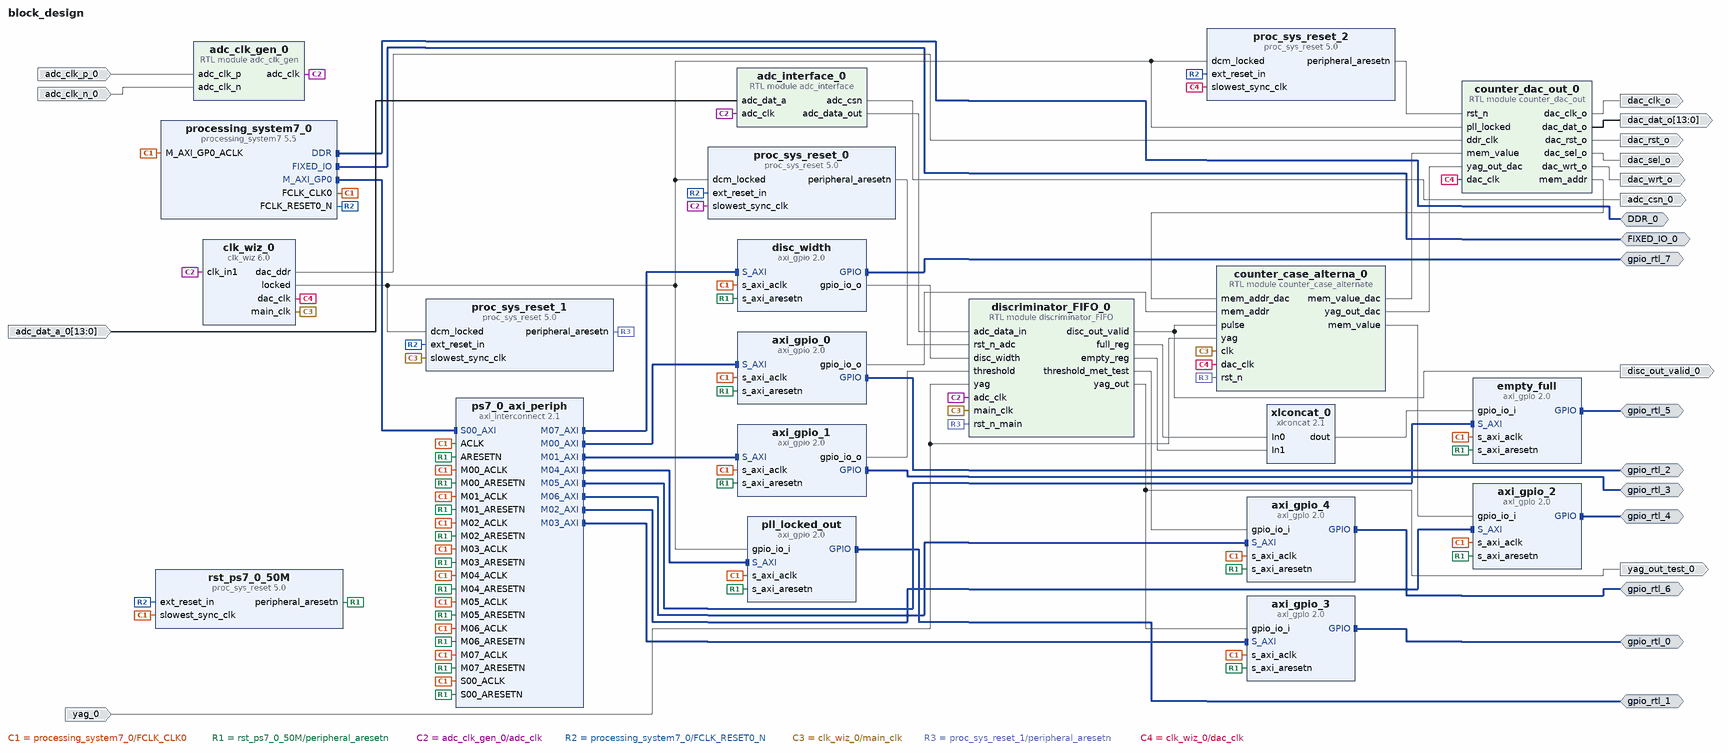
[diagram p0: block diagram of the top level]
# Vivado block design block_design, xc7z010clg400-1, Vivado 2020.2
create_bd_design block_design

create_bd_intf_port -mode Master -vlnv xilinx.com:interface:ddrx_rtl:1.0 DDR_0
create_bd_intf_port -mode Master -vlnv xilinx.com:display_processing_system7:fixedio_rtl:1.0 FIXED_IO_0
create_bd_intf_port -mode Master -vlnv xilinx.com:interface:gpio_rtl:1.0 gpio_rtl_2
create_bd_intf_port -mode Master -vlnv xilinx.com:interface:gpio_rtl:1.0 gpio_rtl_3
create_bd_intf_port -mode Master -vlnv xilinx.com:interface:gpio_rtl:1.0 gpio_rtl_4
create_bd_intf_port -mode Master -vlnv xilinx.com:interface:gpio_rtl:1.0 gpio_rtl_0
create_bd_intf_port -mode Master -vlnv xilinx.com:interface:gpio_rtl:1.0 gpio_rtl_1
create_bd_intf_port -mode Master -vlnv xilinx.com:interface:gpio_rtl:1.0 gpio_rtl_5
create_bd_intf_port -mode Master -vlnv xilinx.com:interface:gpio_rtl:1.0 gpio_rtl_6
create_bd_intf_port -mode Master -vlnv xilinx.com:interface:gpio_rtl:1.0 gpio_rtl_7
create_bd_port -dir I -type clk adc_clk_p_0
set_property -dict {CONFIG.FREQ_HZ 125000000} [get_bd_ports adc_clk_p_0]
create_bd_port -dir I -type clk adc_clk_n_0
set_property -dict {CONFIG.FREQ_HZ 125000000} [get_bd_ports adc_clk_n_0]
create_bd_port -dir I -from 13 -to 0 adc_dat_a_0
create_bd_port -dir O adc_csn_0
create_bd_port -dir I yag_0
create_bd_port -dir O dac_clk_o
create_bd_port -dir O dac_wrt_o
create_bd_port -dir O dac_sel_o
create_bd_port -dir O dac_rst_o
create_bd_port -dir O -from 13 -to 0 dac_dat_o
create_bd_port -dir O yag_out_test_0
create_bd_port -dir O disc_out_valid_0

create_bd_cell -type ip -vlnv xilinx.com:ip:processing_system7:5.5 processing_system7_0
set_property -dict [list \
  CONFIG.PCW_APU_PERIPHERAL_FREQMHZ 666.666666 \
  CONFIG.PCW_ENET0_PERIPHERAL_ENABLE 0 \
  CONFIG.PCW_FPGA0_PERIPHERAL_FREQMHZ 100 \
  CONFIG.PCW_FPGA1_PERIPHERAL_FREQMHZ 50 \
  CONFIG.PCW_GPIO_MIO_GPIO_ENABLE 0 \
  CONFIG.PCW_PERIPHERAL_BOARD_PRESET None \
  CONFIG.PCW_PRESET_BANK1_VOLTAGE {LVCMOS 3.3V} \
  CONFIG.PCW_QSPI_PERIPHERAL_ENABLE 0 \
  CONFIG.PCW_SD0_PERIPHERAL_ENABLE 0 \
  CONFIG.PCW_UART1_PERIPHERAL_ENABLE 0 \
  CONFIG.PCW_UIPARAM_DDR_FREQ_MHZ 533.333333 \
  CONFIG.PCW_UIPARAM_DDR_PARTNO {MT41J128M8 JP-125} \
  CONFIG.PCW_USB0_PERIPHERAL_ENABLE 0 \
] [get_bd_cells processing_system7_0]
# 329 more settings of processing_system7_0 are not shown: defaults, MIO pin electricals, DDR timing, and values the tool derives
create_bd_cell -type ip -vlnv xilinx.com:ip:proc_sys_reset:5.0 rst_ps7_0_50M
create_bd_cell -type ip -vlnv xilinx.com:ip:proc_sys_reset:5.0 proc_sys_reset_0
create_bd_cell -type ip -vlnv xilinx.com:ip:proc_sys_reset:5.0 proc_sys_reset_1
create_bd_cell -type module -reference adc_clk_gen adc_clk_gen_0
create_bd_cell -type ip -vlnv xilinx.com:ip:axi_gpio:2.0 axi_gpio_0
set_property -dict {CONFIG.C_ALL_INPUTS 0 CONFIG.C_ALL_OUTPUTS 1 CONFIG.C_GPIO_WIDTH 12} [get_bd_cells axi_gpio_0]
create_bd_cell -type ip -vlnv xilinx.com:ip:axi_gpio:2.0 axi_gpio_1
set_property -dict {CONFIG.C_ALL_OUTPUTS 1 CONFIG.C_GPIO_WIDTH 14} [get_bd_cells axi_gpio_1]
create_bd_cell -type ip -vlnv xilinx.com:ip:axi_gpio:2.0 axi_gpio_2
set_property -dict {CONFIG.C_ALL_INPUTS 1 CONFIG.C_GPIO_WIDTH 8} [get_bd_cells axi_gpio_2]
create_bd_cell -type ip -vlnv xilinx.com:ip:clk_wiz:6.0 clk_wiz_0
set_property -dict [list \
  CONFIG.AXI_DRP false \
  CONFIG.CLKIN1_JITTER_PS 80.0 \
  CONFIG.CLKIN2_JITTER_PS 133.33 \
  CONFIG.CLKOUT1_DRIVES BUFG \
  CONFIG.CLKOUT1_JITTER 207.253 \
  CONFIG.CLKOUT1_PHASE_ERROR 112.379 \
  CONFIG.CLKOUT1_REQUESTED_OUT_FREQ 11.71875 \
  CONFIG.CLKOUT1_REQUESTED_PHASE -90.000 \
  CONFIG.CLKOUT2_DRIVES BUFG \
  CONFIG.CLKOUT2_JITTER 112.962 \
  CONFIG.CLKOUT2_PHASE_ERROR 112.379 \
  CONFIG.CLKOUT2_REQUESTED_OUT_FREQ 250 \
  CONFIG.CLKOUT2_REQUESTED_PHASE 0 \
  CONFIG.CLKOUT2_USED true \
  CONFIG.CLKOUT3_DRIVES BUFG \
  CONFIG.CLKOUT3_JITTER 237.289 \
  CONFIG.CLKOUT3_PHASE_ERROR 112.379 \
  CONFIG.CLKOUT3_REQUESTED_OUT_FREQ 5.85938 \
  CONFIG.CLKOUT3_USED true \
  CONFIG.CLKOUT4_DRIVES BUFG \
  CONFIG.CLKOUT5_DRIVES BUFG \
  CONFIG.CLKOUT6_DRIVES BUFG \
  CONFIG.CLKOUT7_DRIVES BUFG \
  CONFIG.CLK_OUT1_PORT dac_ddr \
  CONFIG.CLK_OUT2_PORT main_clk \
  CONFIG.CLK_OUT3_PORT dac_clk \
  CONFIG.FEEDBACK_SOURCE FDBK_AUTO \
  CONFIG.INTERFACE_SELECTION Enable_AXI \
  CONFIG.MMCM_BANDWIDTH OPTIMIZED \
  CONFIG.MMCM_CLKFBOUT_MULT_F 6.000 \
  CONFIG.MMCM_CLKIN1_PERIOD 8.000 \
  CONFIG.MMCM_CLKIN2_PERIOD 10.0 \
  CONFIG.MMCM_CLKOUT0_DIVIDE_F 64.000 \
  CONFIG.MMCM_CLKOUT0_PHASE -90.000 \
  CONFIG.MMCM_CLKOUT1_DIVIDE 3 \
  CONFIG.MMCM_CLKOUT1_PHASE 0.000 \
  CONFIG.MMCM_CLKOUT2_DIVIDE 128 \
  CONFIG.MMCM_COMPENSATION ZHOLD \
  CONFIG.MMCM_DIVCLK_DIVIDE 1 \
  CONFIG.NUM_OUT_CLKS 3 \
  CONFIG.PHASE_DUTY_CONFIG false \
  CONFIG.PRIMITIVE MMCM \
  CONFIG.PRIM_IN_FREQ 125.000 \
  CONFIG.PRIM_SOURCE Single_ended_clock_capable_pin \
  CONFIG.SECONDARY_IN_FREQ 100.000 \
  CONFIG.SECONDARY_SOURCE Single_ended_clock_capable_pin \
  CONFIG.USE_DYN_RECONFIG false \
  CONFIG.USE_FREQ_SYNTH true \
  CONFIG.USE_INCLK_SWITCHOVER false \
  CONFIG.USE_LOCKED true \
  CONFIG.USE_RESET false \
] [get_bd_cells clk_wiz_0]
create_bd_cell -type ip -vlnv xilinx.com:ip:axi_interconnect:2.1 ps7_0_axi_periph
set_property -dict {CONFIG.NUM_MI 8} [get_bd_cells ps7_0_axi_periph]
create_bd_cell -type module -reference adc_interface adc_interface_0
create_bd_cell -type ip -vlnv xilinx.com:ip:proc_sys_reset:5.0 proc_sys_reset_2
create_bd_cell -type ip -vlnv xilinx.com:ip:axi_gpio:2.0 axi_gpio_3
set_property -dict {CONFIG.C_ALL_INPUTS 1 CONFIG.C_GPIO_WIDTH 1} [get_bd_cells axi_gpio_3]
create_bd_cell -type module -reference counter_case_alternate counter_case_alterna_0
create_bd_cell -type module -reference counter_dac_out counter_dac_out_0
create_bd_cell -type ip -vlnv xilinx.com:ip:axi_gpio:2.0 pll_locked_out
set_property -dict {CONFIG.C_ALL_INPUTS 1 CONFIG.C_GPIO_WIDTH 1} [get_bd_cells pll_locked_out]
create_bd_cell -type ip -vlnv xilinx.com:ip:xlconcat:2.1 xlconcat_0
create_bd_cell -type ip -vlnv xilinx.com:ip:axi_gpio:2.0 empty_full
set_property -dict {CONFIG.C_ALL_INPUTS 1 CONFIG.C_GPIO_WIDTH 2} [get_bd_cells empty_full]
create_bd_cell -type ip -vlnv xilinx.com:ip:axi_gpio:2.0 axi_gpio_4
set_property -dict {CONFIG.C_ALL_INPUTS 1 CONFIG.C_GPIO_WIDTH 1} [get_bd_cells axi_gpio_4]
create_bd_cell -type ip -vlnv xilinx.com:ip:axi_gpio:2.0 disc_width
set_property -dict {CONFIG.C_ALL_OUTPUTS 1 CONFIG.C_DOUT_DEFAULT 0x00000000 CONFIG.C_GPIO_WIDTH 2} [get_bd_cells disc_width]
create_bd_cell -type module -reference discriminator_FIFO discriminator_FIFO_0

# ---- connections ----

connect_bd_intf_net [get_bd_intf_pins ps7_0_axi_periph/M01_AXI] [get_bd_intf_pins axi_gpio_1/S_AXI]
connect_bd_intf_net [get_bd_intf_pins ps7_0_axi_periph/M00_AXI] [get_bd_intf_pins axi_gpio_0/S_AXI]
connect_bd_intf_net [get_bd_intf_ports FIXED_IO_0] [get_bd_intf_pins processing_system7_0/FIXED_IO]
connect_bd_intf_net [get_bd_intf_ports gpio_rtl_0] [get_bd_intf_pins axi_gpio_3/GPIO]
connect_bd_intf_net [get_bd_intf_ports gpio_rtl_4] [get_bd_intf_pins axi_gpio_2/GPIO]
connect_bd_intf_net [get_bd_intf_pins processing_system7_0/M_AXI_GP0] [get_bd_intf_pins ps7_0_axi_periph/S00_AXI]
connect_bd_intf_net [get_bd_intf_ports DDR_0] [get_bd_intf_pins processing_system7_0/DDR]
connect_bd_intf_net -intf_net axi_gpio_5_GPIO [get_bd_intf_ports gpio_rtl_7] [get_bd_intf_pins disc_width/GPIO]
connect_bd_intf_net [get_bd_intf_ports gpio_rtl_2] [get_bd_intf_pins axi_gpio_0/GPIO]
connect_bd_intf_net [get_bd_intf_pins ps7_0_axi_periph/M03_AXI] [get_bd_intf_pins axi_gpio_3/S_AXI]
connect_bd_intf_net [get_bd_intf_pins ps7_0_axi_periph/M02_AXI] [get_bd_intf_pins axi_gpio_2/S_AXI]
connect_bd_intf_net [get_bd_intf_ports gpio_rtl_1] [get_bd_intf_pins pll_locked_out/GPIO]
connect_bd_intf_net [get_bd_intf_pins ps7_0_axi_periph/M07_AXI] [get_bd_intf_pins disc_width/S_AXI]
connect_bd_intf_net [get_bd_intf_pins ps7_0_axi_periph/M04_AXI] [get_bd_intf_pins pll_locked_out/S_AXI]
connect_bd_intf_net [get_bd_intf_pins ps7_0_axi_periph/M05_AXI] [get_bd_intf_pins empty_full/S_AXI]
connect_bd_intf_net [get_bd_intf_pins ps7_0_axi_periph/M06_AXI] [get_bd_intf_pins axi_gpio_4/S_AXI]
connect_bd_intf_net -intf_net axi_gpio_4_GPIO [get_bd_intf_ports gpio_rtl_5] [get_bd_intf_pins empty_full/GPIO]
connect_bd_intf_net [get_bd_intf_ports gpio_rtl_3] [get_bd_intf_pins axi_gpio_1/GPIO]
connect_bd_intf_net [get_bd_intf_ports gpio_rtl_6] [get_bd_intf_pins axi_gpio_4/GPIO]
connect_bd_net [get_bd_pins processing_system7_0/FCLK_CLK0] \
  [get_bd_pins processing_system7_0/M_AXI_GP0_ACLK] [get_bd_pins rst_ps7_0_50M/slowest_sync_clk] \
  [get_bd_pins axi_gpio_0/s_axi_aclk] [get_bd_pins axi_gpio_1/s_axi_aclk] [get_bd_pins axi_gpio_2/s_axi_aclk] \
  [get_bd_pins ps7_0_axi_periph/ACLK] [get_bd_pins ps7_0_axi_periph/S00_ACLK] [get_bd_pins ps7_0_axi_periph/M00_ACLK] \
  [get_bd_pins ps7_0_axi_periph/M01_ACLK] [get_bd_pins ps7_0_axi_periph/M02_ACLK] [get_bd_pins ps7_0_axi_periph/M03_ACLK] \
  [get_bd_pins axi_gpio_3/s_axi_aclk] [get_bd_pins pll_locked_out/s_axi_aclk] [get_bd_pins ps7_0_axi_periph/M04_ACLK] \
  [get_bd_pins empty_full/s_axi_aclk] [get_bd_pins ps7_0_axi_periph/M05_ACLK] [get_bd_pins axi_gpio_4/s_axi_aclk] \
  [get_bd_pins ps7_0_axi_periph/M06_ACLK] [get_bd_pins disc_width/s_axi_aclk] [get_bd_pins ps7_0_axi_periph/M07_ACLK]
connect_bd_net [get_bd_pins rst_ps7_0_50M/peripheral_aresetn] \
  [get_bd_pins axi_gpio_0/s_axi_aresetn] [get_bd_pins axi_gpio_1/s_axi_aresetn] [get_bd_pins axi_gpio_2/s_axi_aresetn] \
  [get_bd_pins ps7_0_axi_periph/ARESETN] [get_bd_pins ps7_0_axi_periph/S00_ARESETN] \
  [get_bd_pins ps7_0_axi_periph/M00_ARESETN] [get_bd_pins ps7_0_axi_periph/M01_ARESETN] \
  [get_bd_pins ps7_0_axi_periph/M02_ARESETN] [get_bd_pins ps7_0_axi_periph/M03_ARESETN] \
  [get_bd_pins axi_gpio_3/s_axi_aresetn] [get_bd_pins pll_locked_out/s_axi_aresetn] \
  [get_bd_pins ps7_0_axi_periph/M04_ARESETN] [get_bd_pins empty_full/s_axi_aresetn] \
  [get_bd_pins ps7_0_axi_periph/M05_ARESETN] [get_bd_pins axi_gpio_4/s_axi_aresetn] \
  [get_bd_pins ps7_0_axi_periph/M06_ARESETN] [get_bd_pins disc_width/s_axi_aresetn] \
  [get_bd_pins ps7_0_axi_periph/M07_ARESETN]
connect_bd_net [get_bd_pins axi_gpio_0/gpio_io_o] [get_bd_pins counter_case_alterna_0/mem_addr]
connect_bd_net -net yag_0_1 [get_bd_ports yag_0] [get_bd_pins counter_case_alterna_0/yag] [get_bd_pins discriminator_FIFO_0/yag]
connect_bd_net [get_bd_pins counter_dac_out_0/dac_clk_o] [get_bd_ports dac_clk_o]
connect_bd_net [get_bd_pins counter_dac_out_0/dac_wrt_o] [get_bd_ports dac_wrt_o]
connect_bd_net [get_bd_pins counter_dac_out_0/dac_sel_o] [get_bd_ports dac_sel_o]
connect_bd_net [get_bd_pins counter_dac_out_0/dac_rst_o] [get_bd_ports dac_rst_o]
connect_bd_net [get_bd_pins counter_dac_out_0/dac_dat_o] [get_bd_ports dac_dat_o]
connect_bd_net [get_bd_pins counter_dac_out_0/mem_addr] [get_bd_pins counter_case_alterna_0/mem_addr_dac]
connect_bd_net [get_bd_pins axi_gpio_1/gpio_io_o] [get_bd_pins discriminator_FIFO_0/threshold]
connect_bd_net -net adc_clk_p_0_1 [get_bd_ports adc_clk_p_0] [get_bd_pins adc_clk_gen_0/adc_clk_p]
connect_bd_net -net adc_clk_n_0_1 [get_bd_ports adc_clk_n_0] [get_bd_pins adc_clk_gen_0/adc_clk_n]
connect_bd_net -net adc_dat_a_0_1 [get_bd_ports adc_dat_a_0] [get_bd_pins adc_interface_0/adc_dat_a]
connect_bd_net [get_bd_pins adc_interface_0/adc_data_out] [get_bd_pins discriminator_FIFO_0/adc_data_in]
connect_bd_net [get_bd_pins adc_interface_0/adc_csn] [get_bd_ports adc_csn_0]
connect_bd_net -net adc_interface_0_adc_clk1 [get_bd_pins adc_clk_gen_0/adc_clk] \
  [get_bd_pins proc_sys_reset_0/slowest_sync_clk] [get_bd_pins clk_wiz_0/clk_in1] [get_bd_pins adc_interface_0/adc_clk] \
  [get_bd_pins discriminator_FIFO_0/adc_clk]
connect_bd_net [get_bd_pins processing_system7_0/FCLK_RESET0_N] \
  [get_bd_pins rst_ps7_0_50M/ext_reset_in] [get_bd_pins proc_sys_reset_0/ext_reset_in] \
  [get_bd_pins proc_sys_reset_1/ext_reset_in] [get_bd_pins proc_sys_reset_2/ext_reset_in]
connect_bd_net [get_bd_pins clk_wiz_0/locked] \
  [get_bd_pins proc_sys_reset_0/dcm_locked] [get_bd_pins proc_sys_reset_1/dcm_locked] \
  [get_bd_pins proc_sys_reset_2/dcm_locked] [get_bd_pins counter_dac_out_0/pll_locked] [get_bd_pins pll_locked_out/gpio_io_i]
connect_bd_net [get_bd_pins clk_wiz_0/main_clk] \
  [get_bd_pins proc_sys_reset_1/slowest_sync_clk] [get_bd_pins counter_case_alterna_0/clk] \
  [get_bd_pins discriminator_FIFO_0/main_clk]
connect_bd_net [get_bd_pins proc_sys_reset_1/peripheral_aresetn] \
  [get_bd_pins counter_case_alterna_0/rst_n] [get_bd_pins discriminator_FIFO_0/rst_n_main]
connect_bd_net [get_bd_pins clk_wiz_0/dac_clk] \
  [get_bd_pins proc_sys_reset_2/slowest_sync_clk] [get_bd_pins counter_case_alterna_0/dac_clk] \
  [get_bd_pins counter_dac_out_0/dac_clk]
connect_bd_net [get_bd_pins clk_wiz_0/dac_ddr] [get_bd_pins counter_dac_out_0/ddr_clk]
connect_bd_net [get_bd_pins proc_sys_reset_2/peripheral_aresetn] [get_bd_pins counter_dac_out_0/rst_n]
connect_bd_net [get_bd_pins proc_sys_reset_0/peripheral_aresetn] [get_bd_pins discriminator_FIFO_0/rst_n_adc]
connect_bd_net [get_bd_pins discriminator_FIFO_0/yag_out] [get_bd_ports yag_out_test_0] [get_bd_pins axi_gpio_3/gpio_io_i]
connect_bd_net [get_bd_pins counter_case_alterna_0/mem_value] [get_bd_pins axi_gpio_2/gpio_io_i]
connect_bd_net [get_bd_pins counter_case_alterna_0/mem_value_dac] [get_bd_pins counter_dac_out_0/mem_value]
connect_bd_net [get_bd_pins counter_case_alterna_0/yag_out_dac] [get_bd_pins counter_dac_out_0/yag_out_dac]
connect_bd_net [get_bd_pins discriminator_FIFO_0/full_reg] [get_bd_pins xlconcat_0/In0]
connect_bd_net [get_bd_pins discriminator_FIFO_0/empty_reg] [get_bd_pins xlconcat_0/In1]
connect_bd_net [get_bd_pins xlconcat_0/dout] [get_bd_pins empty_full/gpio_io_i]
connect_bd_net [get_bd_pins discriminator_FIFO_0/disc_out_valid] [get_bd_ports disc_out_valid_0] [get_bd_pins counter_case_alterna_0/pulse]
connect_bd_net [get_bd_pins discriminator_FIFO_0/threshold_met_test] [get_bd_pins axi_gpio_4/gpio_io_i]
connect_bd_net [get_bd_pins disc_width/gpio_io_o] [get_bd_pins discriminator_FIFO_0/disc_width]

# ---- address map ----
assign_bd_address -offset 0x41200000 -range 64K -target_address_space [get_bd_addr_spaces processing_system7_0/Data] [get_bd_addr_segs axi_gpio_0/S_AXI/Reg]
assign_bd_address -offset 0x41210000 -range 64K -target_address_space [get_bd_addr_spaces processing_system7_0/Data] [get_bd_addr_segs axi_gpio_1/S_AXI/Reg]
assign_bd_address -offset 0x41220000 -range 64K -target_address_space [get_bd_addr_spaces processing_system7_0/Data] [get_bd_addr_segs axi_gpio_2/S_AXI/Reg]
assign_bd_address -offset 0x41230000 -range 64K -target_address_space [get_bd_addr_spaces processing_system7_0/Data] [get_bd_addr_segs axi_gpio_3/S_AXI/Reg]
assign_bd_address -offset 0x41240000 -range 64K -target_address_space [get_bd_addr_spaces processing_system7_0/Data] [get_bd_addr_segs pll_locked_out/S_AXI/Reg]
assign_bd_address -offset 0x41250000 -range 64K -target_address_space [get_bd_addr_spaces processing_system7_0/Data] [get_bd_addr_segs empty_full/S_AXI/Reg]
assign_bd_address -offset 0x41260000 -range 64K -target_address_space [get_bd_addr_spaces processing_system7_0/Data] [get_bd_addr_segs axi_gpio_4/S_AXI/Reg]
assign_bd_address -offset 0x41270000 -range 64K -target_address_space [get_bd_addr_spaces processing_system7_0/Data] [get_bd_addr_segs disc_width/S_AXI/Reg]

validate_bd_design
save_bd_design
